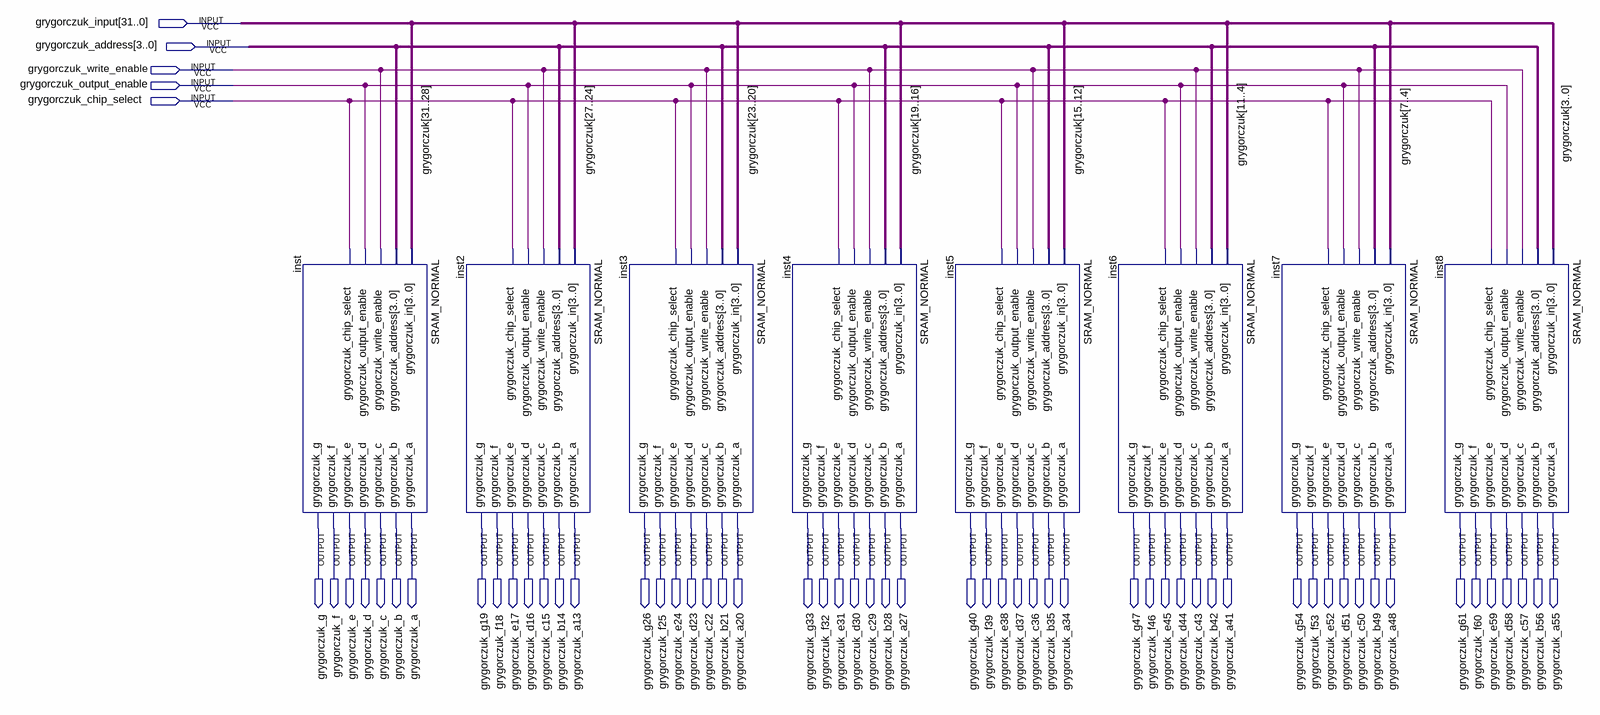
[diagram p0: schematic sheet]
// Quartus schematic SRAM_SIXTEEN_BY_THIRTY_TWO.bdf as structural Verilog: 8 symbols, 61 pins
module SRAM_SIXTEEN_BY_THIRTY_TWO (
  input  [31:0] grygorczuk_input,
  input  [3:0] grygorczuk_address,
  input  grygorczuk_write_enable,
  input  grygorczuk_output_enable,
  input  grygorczuk_chip_select,
  output grygorczuk_g,
  output grygorczuk_f,
  output grygorczuk_e,
  output grygorczuk_d,
  output grygorczuk_c,
  output grygorczuk_b,
  output grygorczuk_a,
  output grygorczuk_g19,
  output grygorczuk_f18,
  output grygorczuk_e17,
  output grygorczuk_d16,
  output grygorczuk_c15,
  output grygorczuk_b14,
  output grygorczuk_a13,
  output grygorczuk_g26,
  output grygorczuk_f25,
  output grygorczuk_e24,
  output grygorczuk_d23,
  output grygorczuk_c22,
  output grygorczuk_b21,
  output grygorczuk_a20,
  output grygorczuk_g33,
  output grygorczuk_f32,
  output grygorczuk_e31,
  output grygorczuk_d30,
  output grygorczuk_c29,
  output grygorczuk_b28,
  output grygorczuk_a27,
  output grygorczuk_g40,
  output grygorczuk_f39,
  output grygorczuk_e38,
  output grygorczuk_d37,
  output grygorczuk_c36,
  output grygorczuk_b35,
  output grygorczuk_a34,
  output grygorczuk_g47,
  output grygorczuk_f46,
  output grygorczuk_e45,
  output grygorczuk_d44,
  output grygorczuk_c43,
  output grygorczuk_b42,
  output grygorczuk_a41,
  output grygorczuk_g54,
  output grygorczuk_f53,
  output grygorczuk_e52,
  output grygorczuk_d51,
  output grygorczuk_c50,
  output grygorczuk_b49,
  output grygorczuk_a48,
  output grygorczuk_g61,
  output grygorczuk_f60,
  output grygorczuk_e59,
  output grygorczuk_d58,
  output grygorczuk_c57,
  output grygorczuk_b56,
  output grygorczuk_a55
);

  wire [31:0] grygorczuk;

  SRAM_NORMAL inst (
    .grygorczuk_in(grygorczuk[31:28]), .grygorczuk_address(grygorczuk_address),
    .grygorczuk_write_enable(grygorczuk_write_enable), .grygorczuk_output_enable(grygorczuk_output_enable),
    .grygorczuk_chip_select(grygorczuk_chip_select), .grygorczuk_a(grygorczuk_a),
    .grygorczuk_b(grygorczuk_b), .grygorczuk_c(grygorczuk_c), .grygorczuk_d(grygorczuk_d),
    .grygorczuk_e(grygorczuk_e), .grygorczuk_f(grygorczuk_f), .grygorczuk_g(grygorczuk_g));
  SRAM_NORMAL inst2 (
    .grygorczuk_in(grygorczuk[27:24]), .grygorczuk_address(grygorczuk_address),
    .grygorczuk_write_enable(grygorczuk_write_enable), .grygorczuk_output_enable(grygorczuk_output_enable),
    .grygorczuk_chip_select(grygorczuk_chip_select), .grygorczuk_a(grygorczuk_a13),
    .grygorczuk_b(grygorczuk_b14), .grygorczuk_c(grygorczuk_c15), .grygorczuk_d(grygorczuk_d16),
    .grygorczuk_e(grygorczuk_e17), .grygorczuk_f(grygorczuk_f18), .grygorczuk_g(grygorczuk_g19));
  SRAM_NORMAL inst3 (
    .grygorczuk_in(grygorczuk[23:20]), .grygorczuk_address(grygorczuk_address),
    .grygorczuk_write_enable(grygorczuk_write_enable), .grygorczuk_output_enable(grygorczuk_output_enable),
    .grygorczuk_chip_select(grygorczuk_chip_select), .grygorczuk_a(grygorczuk_a20),
    .grygorczuk_b(grygorczuk_b21), .grygorczuk_c(grygorczuk_c22), .grygorczuk_d(grygorczuk_d23),
    .grygorczuk_e(grygorczuk_e24), .grygorczuk_f(grygorczuk_f25), .grygorczuk_g(grygorczuk_g26));
  SRAM_NORMAL inst4 (
    .grygorczuk_in(grygorczuk[19:16]), .grygorczuk_address(grygorczuk_address),
    .grygorczuk_write_enable(grygorczuk_write_enable), .grygorczuk_output_enable(grygorczuk_output_enable),
    .grygorczuk_chip_select(grygorczuk_chip_select), .grygorczuk_a(grygorczuk_a27),
    .grygorczuk_b(grygorczuk_b28), .grygorczuk_c(grygorczuk_c29), .grygorczuk_d(grygorczuk_d30),
    .grygorczuk_e(grygorczuk_e31), .grygorczuk_f(grygorczuk_f32), .grygorczuk_g(grygorczuk_g33));
  SRAM_NORMAL inst5 (
    .grygorczuk_in(grygorczuk[15:12]), .grygorczuk_address(grygorczuk_address),
    .grygorczuk_write_enable(grygorczuk_write_enable), .grygorczuk_output_enable(grygorczuk_output_enable),
    .grygorczuk_chip_select(grygorczuk_chip_select), .grygorczuk_a(grygorczuk_a34),
    .grygorczuk_b(grygorczuk_b35), .grygorczuk_c(grygorczuk_c36), .grygorczuk_d(grygorczuk_d37),
    .grygorczuk_e(grygorczuk_e38), .grygorczuk_f(grygorczuk_f39), .grygorczuk_g(grygorczuk_g40));
  SRAM_NORMAL inst6 (
    .grygorczuk_in(grygorczuk[11:4]), .grygorczuk_address(grygorczuk_address),
    .grygorczuk_write_enable(grygorczuk_write_enable), .grygorczuk_output_enable(grygorczuk_output_enable),
    .grygorczuk_chip_select(grygorczuk_chip_select), .grygorczuk_a(grygorczuk_a41),
    .grygorczuk_b(grygorczuk_b42), .grygorczuk_c(grygorczuk_c43), .grygorczuk_d(grygorczuk_d44),
    .grygorczuk_e(grygorczuk_e45), .grygorczuk_f(grygorczuk_f46), .grygorczuk_g(grygorczuk_g47));
  SRAM_NORMAL inst7 (
    .grygorczuk_in(grygorczuk[7:4]), .grygorczuk_address(grygorczuk_address),
    .grygorczuk_write_enable(grygorczuk_write_enable), .grygorczuk_output_enable(grygorczuk_output_enable),
    .grygorczuk_chip_select(grygorczuk_chip_select), .grygorczuk_a(grygorczuk_a48),
    .grygorczuk_b(grygorczuk_b49), .grygorczuk_c(grygorczuk_c50), .grygorczuk_d(grygorczuk_d51),
    .grygorczuk_e(grygorczuk_e52), .grygorczuk_f(grygorczuk_f53), .grygorczuk_g(grygorczuk_g54));
  SRAM_NORMAL inst8 (
    .grygorczuk_in(grygorczuk[3:0]), .grygorczuk_address(grygorczuk_address),
    .grygorczuk_write_enable(grygorczuk_write_enable), .grygorczuk_output_enable(grygorczuk_output_enable),
    .grygorczuk_chip_select(grygorczuk_chip_select), .grygorczuk_a(grygorczuk_a55),
    .grygorczuk_b(grygorczuk_b56), .grygorczuk_c(grygorczuk_c57), .grygorczuk_d(grygorczuk_d58),
    .grygorczuk_e(grygorczuk_e59), .grygorczuk_f(grygorczuk_f60), .grygorczuk_g(grygorczuk_g61));
endmodule
